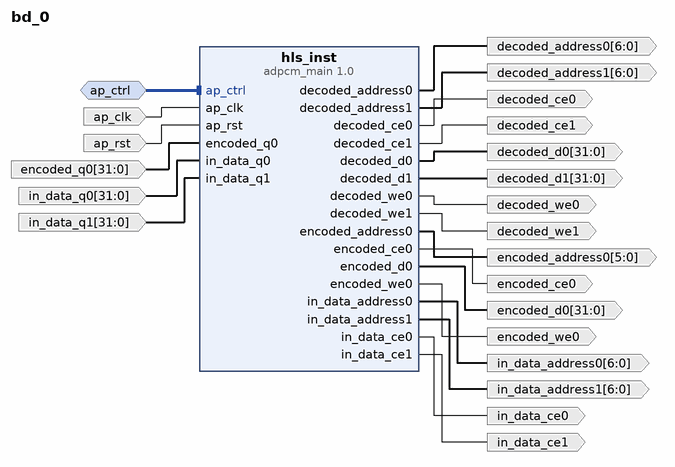
[diagram p0: block diagram of the top level]
# Vivado block design bd_0, xcu50-fsvh2104-2-e, Vivado 2023.2
create_bd_design bd_0

create_bd_intf_port -mode Slave -vlnv xilinx.com:interface:acc_handshake_rtl:1.0 ap_ctrl
create_bd_port -dir I -type clk ap_clk
set_property -dict {CONFIG.FREQ_HZ 125000000.0} [get_bd_ports ap_clk]
create_bd_port -dir I -type rst ap_rst
set_property -dict {CONFIG.POLARITY ACTIVE_HIGH} [get_bd_ports ap_rst]
create_bd_port -dir O -from 6 -to 0 -type data decoded_address0
create_bd_port -dir O -from 6 -to 0 -type data decoded_address1
create_bd_port -dir O decoded_ce0
create_bd_port -dir O decoded_ce1
create_bd_port -dir O -from 31 -to 0 -type data decoded_d0
create_bd_port -dir O -from 31 -to 0 -type data decoded_d1
create_bd_port -dir O decoded_we0
create_bd_port -dir O decoded_we1
create_bd_port -dir O -from 5 -to 0 -type data encoded_address0
create_bd_port -dir O encoded_ce0
create_bd_port -dir O -from 31 -to 0 -type data encoded_d0
create_bd_port -dir I -from 31 -to 0 -type data encoded_q0
create_bd_port -dir O encoded_we0
create_bd_port -dir O -from 6 -to 0 -type data in_data_address0
create_bd_port -dir O -from 6 -to 0 -type data in_data_address1
create_bd_port -dir O in_data_ce0
create_bd_port -dir O in_data_ce1
create_bd_port -dir I -from 31 -to 0 -type data in_data_q0
create_bd_port -dir I -from 31 -to 0 -type data in_data_q1

create_bd_cell -type ip -vlnv xilinx.com:hls:adpcm_main:1.0 hls_inst

# ---- connections ----

connect_bd_intf_net -intf_net ap_ctrl_0_1 [get_bd_intf_ports ap_ctrl] [get_bd_intf_pins hls_inst/ap_ctrl]
connect_bd_net -net ap_clk_0_1 [get_bd_ports ap_clk] [get_bd_pins hls_inst/ap_clk]
connect_bd_net -net ap_rst_0_1 [get_bd_ports ap_rst] [get_bd_pins hls_inst/ap_rst]
connect_bd_net -net encoded_q0_0_1 [get_bd_ports encoded_q0] [get_bd_pins hls_inst/encoded_q0]
connect_bd_net [get_bd_pins hls_inst/decoded_address0] [get_bd_ports decoded_address0]
connect_bd_net [get_bd_pins hls_inst/decoded_address1] [get_bd_ports decoded_address1]
connect_bd_net [get_bd_pins hls_inst/decoded_ce0] [get_bd_ports decoded_ce0]
connect_bd_net [get_bd_pins hls_inst/decoded_ce1] [get_bd_ports decoded_ce1]
connect_bd_net [get_bd_pins hls_inst/decoded_d0] [get_bd_ports decoded_d0]
connect_bd_net [get_bd_pins hls_inst/decoded_d1] [get_bd_ports decoded_d1]
connect_bd_net [get_bd_pins hls_inst/decoded_we0] [get_bd_ports decoded_we0]
connect_bd_net [get_bd_pins hls_inst/decoded_we1] [get_bd_ports decoded_we1]
connect_bd_net [get_bd_pins hls_inst/encoded_address0] [get_bd_ports encoded_address0]
connect_bd_net [get_bd_pins hls_inst/encoded_ce0] [get_bd_ports encoded_ce0]
connect_bd_net [get_bd_pins hls_inst/encoded_d0] [get_bd_ports encoded_d0]
connect_bd_net [get_bd_pins hls_inst/encoded_we0] [get_bd_ports encoded_we0]
connect_bd_net [get_bd_pins hls_inst/in_data_address0] [get_bd_ports in_data_address0]
connect_bd_net [get_bd_pins hls_inst/in_data_address1] [get_bd_ports in_data_address1]
connect_bd_net [get_bd_pins hls_inst/in_data_ce0] [get_bd_ports in_data_ce0]
connect_bd_net [get_bd_pins hls_inst/in_data_ce1] [get_bd_ports in_data_ce1]
connect_bd_net -net in_data_q0_0_1 [get_bd_ports in_data_q0] [get_bd_pins hls_inst/in_data_q0]
connect_bd_net -net in_data_q1_0_1 [get_bd_ports in_data_q1] [get_bd_pins hls_inst/in_data_q1]

validate_bd_design
save_bd_design
